# Altium schematic sheet Schematic.SchDoc
size A4
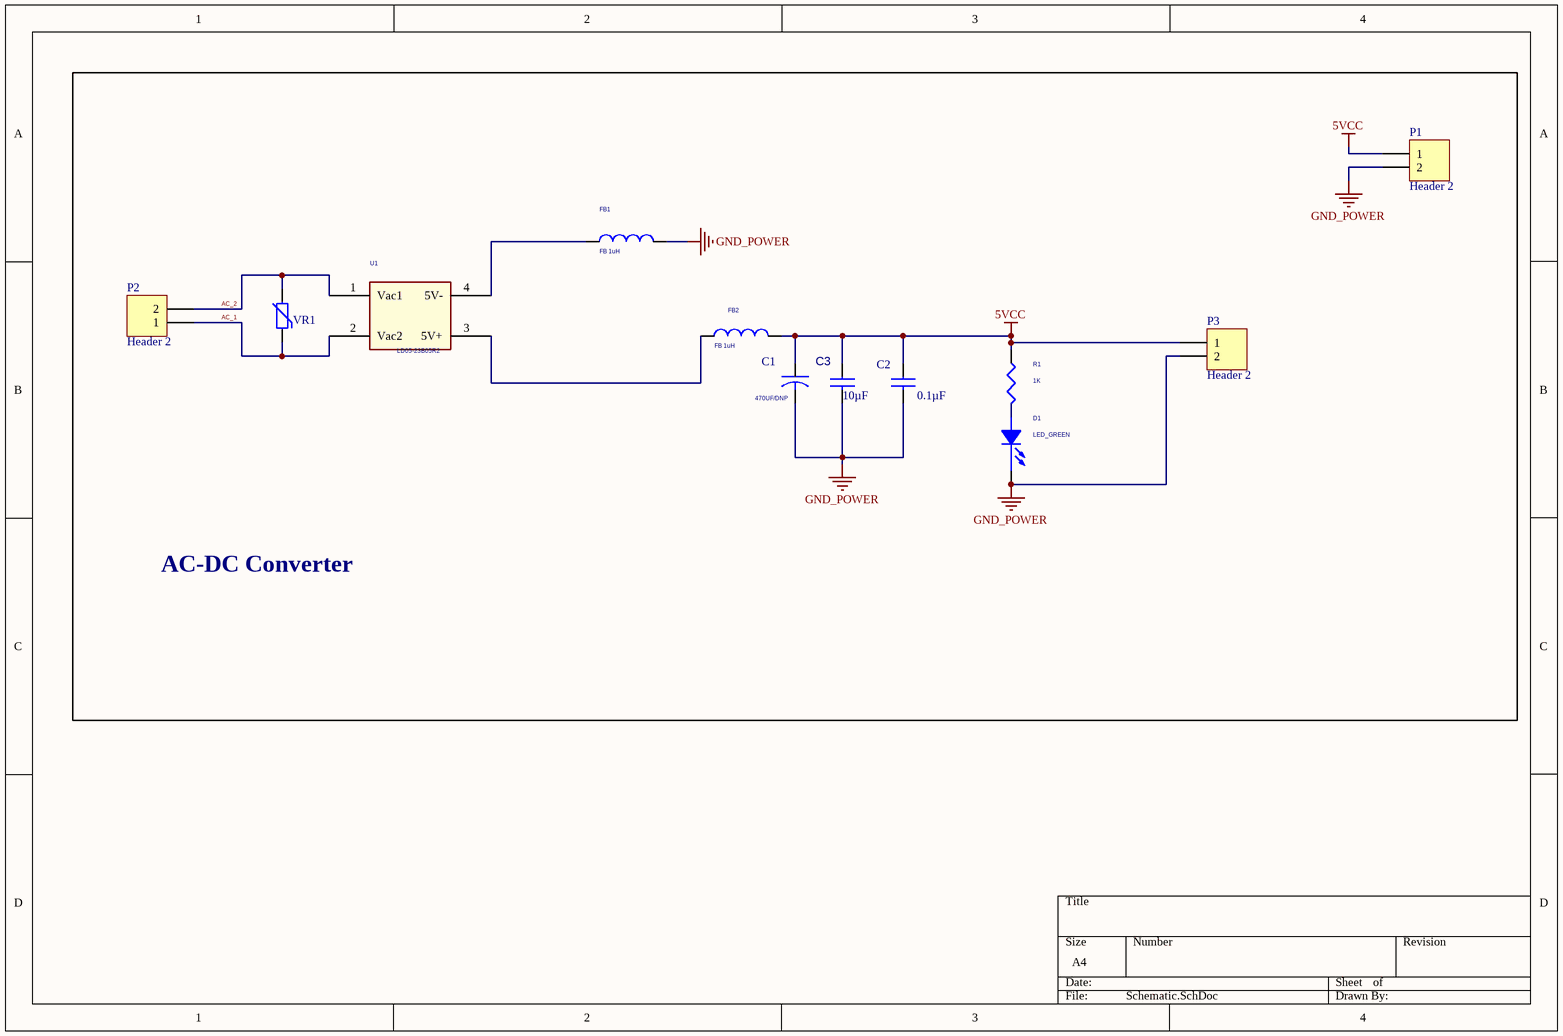
[diagram p0: Schematic.SchDoc]

## Parts
C1  10µF  [0603 Capacitor]
C2  0.1µF  [0603 Capacitor]
C3  470UF/DNP  [25ZLH470MEFC10X12.5]
D1  LED_GREEN  [R_0603_W]
FB1  FB 1uH  [0603 Capacitor]
FB2  FB 1uH  [0603 Capacitor]
P1  Header 2  [HDR1X2]
P2  Header 2  [TE 282834-2]
P3  Header 2  [HDR1X2]
R1  1K  [R_0603_W]
U1  LD05-23B05R2  [CONV_LD05-23B03R2]
VR1  (no value)  [Mov]

## Blocks framed on the sheet
AC-DC Converter: C1-C3 D1 FB1 FB2 P1-P3 R1 U1 VR1

## Nets
5VCC: C1.1 C2.1 C3.1 FB2.2 P1.1 P3.1 R1.1
GND_POWER: C1.2 C2.2 C3.2 D1.2(CATHODE) FB1.2 P1.2 P3.2
AC_1: P2.1 U1.2(Vac2) VR1.1
AC_2: P2.2 U1.1(Vac1) VR1.2
NetD1_1: D1.1(ANODE) R1.2
NetFB1_1: FB1.1 U1.4(5V-)
NetFB2_1: FB2.1 U1.3(5V+)

## Library data of the parts
C1 = CAP_C_10µF/35V: CAP CER SMD 10µF/35V; Manufacturer: Taiyo Yuden; Manufacturer Part Number: GMK316AB7106KL-TR; Tolerance: ±10%; Voltage - Rated: 35V; Temperature Coefficient: X7R; Supplier 1: Digi-Key; Supplier Part Number 1: 587-3007-1-ND; RoHS: RoHS Compliant; Category: Capacitors; Stock 1: 533940; Pricing 1: 1=0.51, 10=0.362, 25=0.3092, 50=0.274, 100=0.2387, 250=0.20328, 500=0.17678, 1000=0.15026 (USD); Packaging: Cut Tape (CT); Part Status: Active; Capacitance: 10µF; Operating Temperature: -55°C ~ 125°C; Features: -; Ratings: -; Applications: General Purpose; Mounting Type: Surface Mount, MLCC; Package / Case: 1206 (3216 Metric); Size / Dimension: 0.126" L x 0.063" W (3.20mm x 1.60mm); Height - Seated (Max): -; Thickness (Max): 0.071" (1.80mm); Lead Spacing: -; Lead Style: -; ComponentLink1URL: http://www.yuden.co.jp/productdata/catalog/en/mlcc06_e.pdf; ComponentLink1Description: http://www.yuden.co.jp/productdata/catalog/en/mlcc06_e.pdf
C2 = CAP_C_0.1µF/50V: CAP CER SMD 0.1µF/50V; Manufacturer: Yageo; Manufacturer Part Number: CC0805ZRY5V9BB104; Tolerance: -20%, +80%; Voltage - Rated: 50V; Temperature Coefficient: Y5V (F); Supplier 1: Digi-Key; Supplier Part Number 1: 311-1361-1-ND; RoHS: RoHS Compliant; Category: Capacitors; Stock 1: 934185; Pricing 1: 1=0.1, 10=0.036, 25=0.0264, 50=0.0198, 100=0.0162, 250=0.01352, 500=0.01156, 1000=0.00908 (USD); Packaging: Cut Tape (CT); Part Status: Active; Capacitance: 0.1µF; Operating Temperature: -30°C ~ 85°C; Features: -; Ratings: -; Applications: General Purpose; Failure Rate: -; Mounting Type: Surface Mount, MLCC; Package / Case: 0805 (2012 Metric); Size / Dimension: 0.079" L x 0.049" W (2.00mm x 1.25mm); Height - Seated (Max): -; Thickness (Max): 0.024" (0.60mm); Lead Spacing: -; Lead Style: -; ComponentLink1URL: http://www.yageo.com/documents/recent/UPY-GPHC_Y5V_6.3V-to-50V_8.pdf; ComponentLink1Description: http://www.yageo.com/documents/recent/UPY-GPHC_Y5V_6.3V-to-50V_8.pdf
C3 = CAP: CAP ALUM 470UF 20% 50V RADIAL; Part Number: P12400-ND
D1 = LED: LED GREEN CLEAR THIN 0603 SMD; Manufacturer Part Number: 160-1443-2-ND; Type: Diode; Distributor Part Number: 160-1443-1-ND; Package: 0603; Part Number: 160-1443-2-ND
FB1 = INDUCTOR: FILTER CHIP 120 OHM 3A 0603; Part Number: MMZ2012Y152B; Manufacturer Part Number: 490-4004-2-ND; Type: Ferrite; Distributor Part Number: 1276-6357-1-ND; Package: 0603
FB2 = INDUCTOR: FILTER CHIP 120 OHM 3A 0603; Manufacturer Part Number: 490-4004-2-ND; Type: Ferrite; Distributor Part Number: 1276-6357-1-ND; Package: 0603; Part Number: 490-4004-2-ND
P1-P3 = Header 2: Header, 2-Pin; LatestRevisionDate: 17-Jul-2002; LatestRevisionNote: Re-released for DXP Platform.; Publisher: Altium Limited
R1 = R: RES SMD 1K OHM 5% 1/10W 0603; Part Number: 311-1.0KGRTR-ND; Package: 0603; Type: Resistor
U1 = 2_PIN_PSH_BTTN_6: Part Number: MOV-10D431KTRCT-ND
VR1 = Metal Oxide Variaster: SMT Resistor; Value: ="Resistance in Ohms @ 25C"